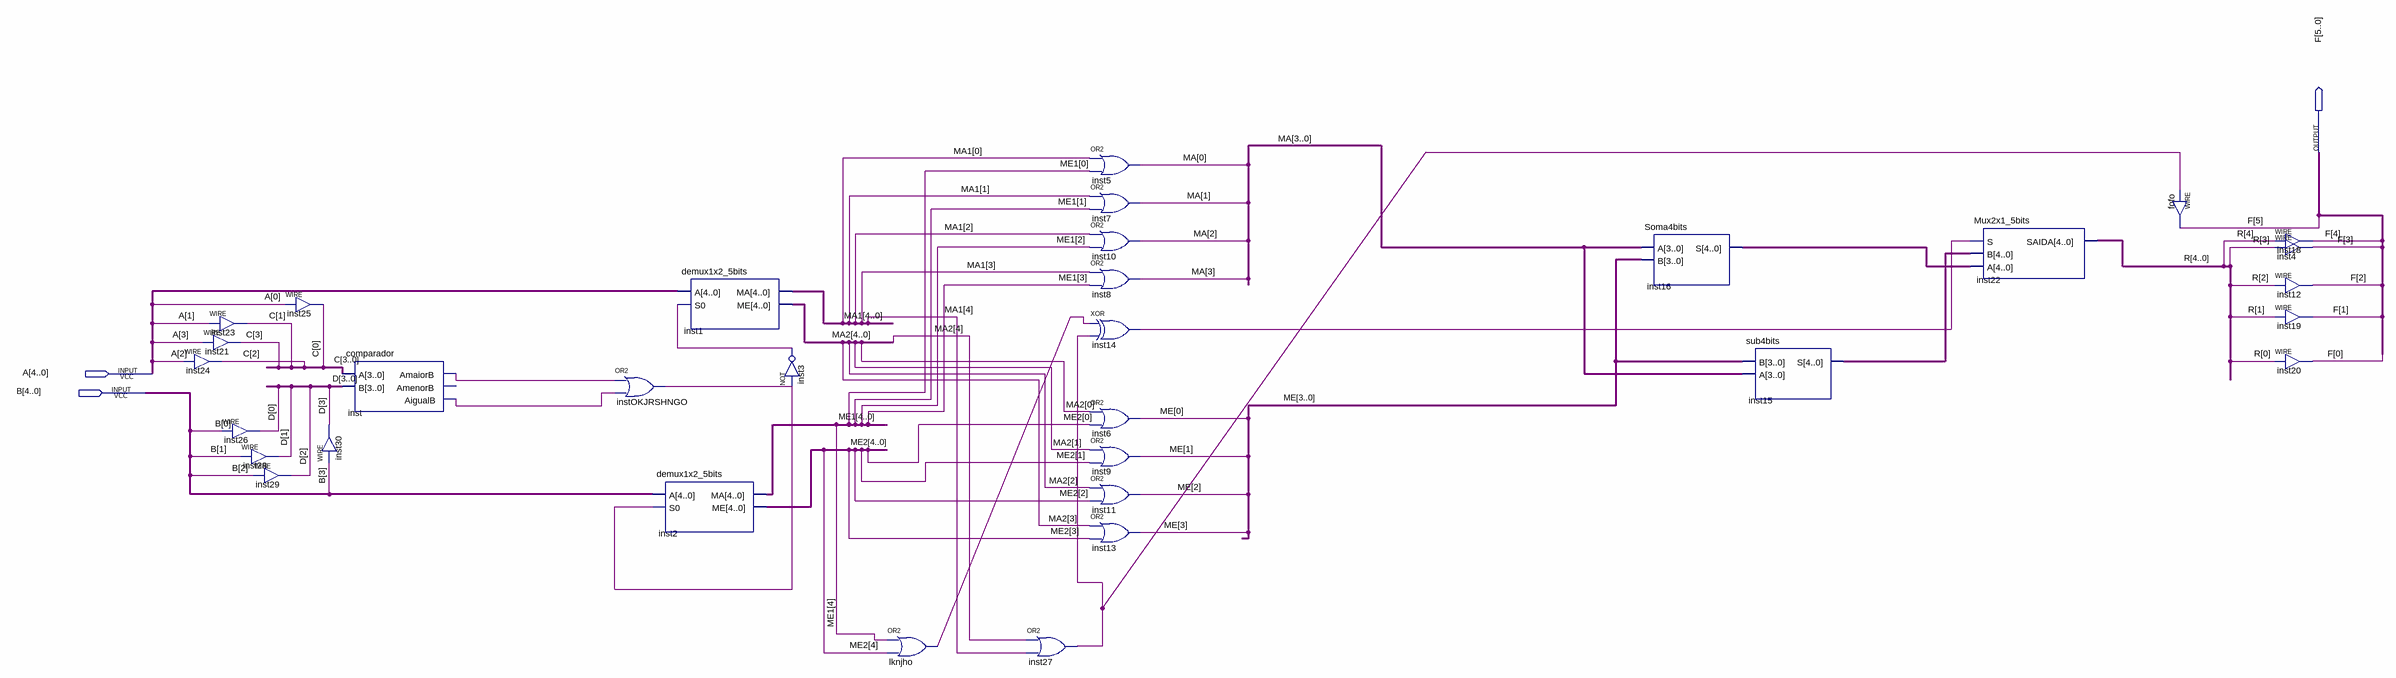
[diagram p0: schematic sheet]
// Quartus schematic Somador.bdf as structural Verilog: 33 symbols, 3 pins
module Somador (
  input  [4:0] A,
  input  [4:0] B,
  output [5:0] F
);

  wire inst3_out, inst14_out, inst27_out, inst_aigualb, inst_amaiorb, instOKJRSHNGO_out, lknjho_out;
  wire [3:0] C, D, MA, ME;
  wire [4:0] inst15_s, inst16_s, MA1, MA2, ME1, ME2, R;

  assign C[1] = A[1];  // WIRE inst23
  assign C[3] = A[3];  // WIRE inst21
  assign C[2] = A[2];  // WIRE inst24
  assign D[0] = B[0];  // WIRE inst26
  assign D[1] = B[1];  // WIRE inst28
  assign D[2] = B[2];  // WIRE inst29
  assign C[0] = A[0];  // WIRE inst25
  comparador inst (.A(C), .B(D), .AmaiorB(inst_amaiorb), .AigualB(inst_aigualb));  // open: AmenorB
  assign D[3] = B[3];  // WIRE inst30
  or instOKJRSHNGO (instOKJRSHNGO_out, inst_amaiorb, inst_aigualb);
  demux1x2_5bits inst2 (.A(B), .S0(instOKJRSHNGO_out), .MA(ME1), .ME(ME2));
  demux1x2_5bits inst1 (.A(A), .S0(inst3_out), .MA(MA1), .ME(MA2));
  not inst3 (inst3_out, instOKJRSHNGO_out);
  or lknjho (lknjho_out, ME1[4], ME2[4]);
  or inst27 (inst27_out, MA2[4], MA1[4]);
  or inst5 (MA[0], MA1[0], ME1[0]);
  or inst7 (MA[1], MA1[1], ME1[1]);
  or inst10 (MA[2], MA1[2], ME1[2]);
  or inst8 (MA[3], MA1[3], ME1[3]);
  xor inst14 (inst14_out, lknjho_out, inst27_out);
  or inst6 (ME[0], MA2[0], ME2[0]);
  or inst9 (ME[1], MA2[1], ME2[1]);
  or inst11 (ME[2], MA2[2], ME2[2]);
  or inst13 (ME[3], MA2[3], ME2[3]);
  Soma4bits inst16 (.A(MA), .B(ME), .S(inst16_s));
  sub4bits inst15 (.B(ME), .A(MA), .S(inst15_s));
  Mux2x1_5bits inst22 (.S(inst14_out), .B(inst15_s), .A(inst16_s), .SAIDA(R));
  assign F[5] = inst27_out;  // WIRE fofo
  assign F[4] = R[4];  // WIRE inst18
  assign F[3] = R[3];  // WIRE inst4
  assign F[2] = R[2];  // WIRE inst12
  assign F[1] = R[1];  // WIRE inst19
  assign F[0] = R[0];  // WIRE inst20
endmodule
